# Altium schematic sheet rs232.SchDoc
size A
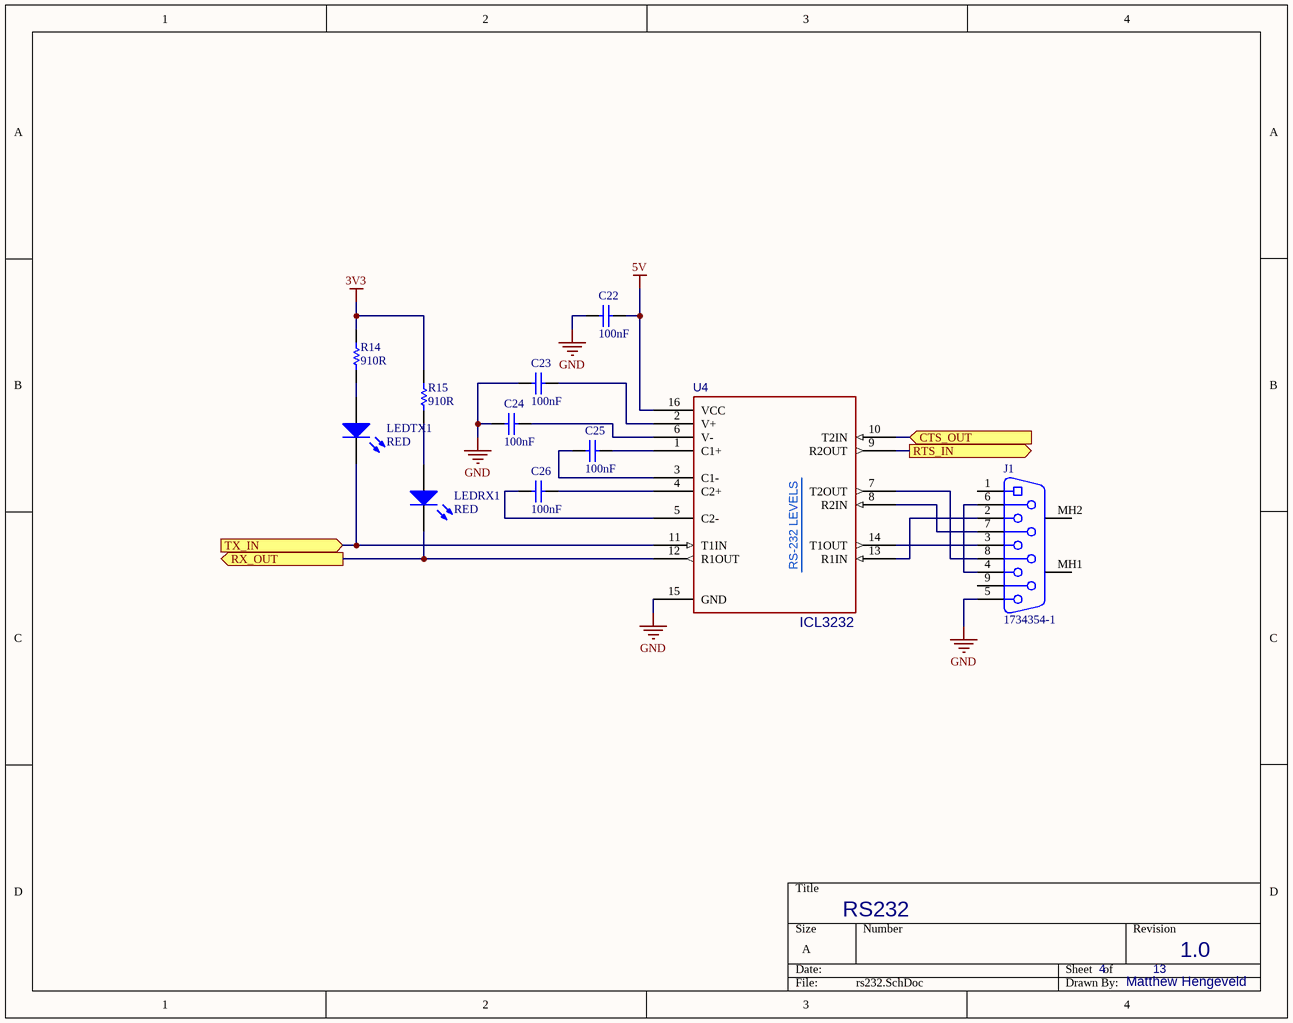
[diagram p0: rs232.SchDoc]

## Parts
C22  100nF  [CAPC1608X92X38LL15T08]
C23  100nF  [CAPC2013X94X50LL20T25]
C24  100nF  [CAPC2013X94X50LL20T25]
C25  100nF  [CAPC2013X94X50LL20T25]
C26  100nF  [CAPC2013X94X50LL20T25]
J1  1734354-1  [TE-1734354-1-9_V]
LEDRX1  RED  [0805_A]
LEDTX1  RED  [0805_A]
R14  910R  [RESC1609X50X30LL10T20]
R15  910R  [RESC1609X50X30LL10T20]
U4  RS232 Transciever  [TSSOP-16]  (value not drawn)

## Ports
CTS_OUT (in), RTS_IN (out), RX_OUT (out), TX_IN (in)

## Nets
3V3: R14.2 R15.2
5V: C22.2 U4.16(VCC)
GND: C22.1 C23.2 C24.2 J1.5 U4.15(GND)
CTS_OUT: U4.10(T2IN) ; port CTS_OUT
RTS_IN: U4.9(R2OUT) ; port RTS_IN
RX_OUT: LEDRX1.1(K) U4.12(R1OUT) ; port RX_OUT
TX_IN: LEDTX1.1(K) U4.11(T1IN) ; port TX_IN
NetC23_1: C23.1 U4.2(V+)
NetC24_1: C24.1 U4.6(V-)
NetC25_1: C25.1 U4.1(C1+)
NetC25_2: C25.2 U4.3(C1-)
NetC26_1: C26.1 U4.5(C2-)
NetC26_2: C26.2 U4.4(C2+)
NetJ1_2: J1.2 U4.13(R1IN)
NetJ1_3: J1.3 U4.14(T1OUT)
NetJ1_4: J1.4 J1.6
NetJ1_7: J1.7 U4.8(R2IN)
NetJ1_8: J1.8 U4.7(T2OUT)
NetLEDRX1_2: LEDRX1.2(A) R15.1
NetLEDTX1_2: LEDTX1.2(A) R14.1

Not connected (* = marked no-connect by the designer): J1 1 9 MH1 MH2

## Notes on the sheet
- RS232
- 4
- 13
- 1.0
- Matthew Hengeveld
- (in symbol ICL3232) RS-232 LEVELS

## Library data of the parts
C22 = CMP-2006-01974-1: Part Number: VJ0603Y104KNXAO; Manufacturer: Vitramon
C23-C26 = CMP-2007-04370-1: Part Number: 08055C104K4T2A; Manufacturer: AVX Interconnect / Elco
J1 = CMP-2000-05403-1: D-Subminiature Socket, Pitch 1.385 mm, 9 Position, Height 12.5 mm, Tail Length 3.2 mm, RoHS, Tray; Manufacturer: TE Connectivity; Connector Type: Receptacle,FemaleSockets; Number of Positions: 9; Connector Style: D-Sub; Catalog Drawings: AMPD-SubMale.318; 3D Model: 1734354-1.pdf; Flange Feature: MatingSide;FemaleScrewlock(4-40); Other Names: A35107; Current Rating: 2A; Voltage Rating: 250V; Mating Products: AML09B-ND / -CONND-SUBPLUG9POSGOLD; Featured Product: AMPLIMITED-SubminiatureConnectors; Product Training Modules: AMPLIMITED-SubConnectors; Dynamic Catalog: AMPLIMITEHD-20Series; Manufacturer URL: http://www.te.com/; Number of Rows: 2; Contact Type: Signal; RoHS Information: 1734354-1StatementofCompliance; Datasheet URL: http://www.te.com.cn/chn-zh/search.html?q=1734354-1&source=header#pdp-optional-registration; Features: BoardLock; Standard Package: 90; Family: D-SubConnectors; Datasheet Version: Rev. A1, 03/2011; Shell Material, Finish: Steel,NickelPlated; Color: Black; Contact Finish Thickness: Flash; Shell Size, Connector Layout: 1(DE,E); Mounting Type: ThroughHole,RightAngle; Contact Finish: Gold; Termination: Solder; Housing Material: Polyamide(PA9T),Nylon9T,GlassFilled; Operating Temperature: -55degC~105degC; Category: Connectors,Interconnects; Series: AMPLIMITEHD-20
LEDRX1 LEDTX1 = CMP-1426-00011-1: SMD mono-color Chip LED, WL-SMCW, Red; PartNumber: 150080RS75000; Manufacturer: Wuerth Elektronik; Color: Red; PackageReference: 0805_A; ComponentLink2Description: Datasheet; ComponentLink1URL: http://www.we-online.com; ComponentLink1Description: Manufacturer URL; ComponentLink2URL: http://katalog.we-online.com/led/datasheet/150080RS75000.pdf
R14 R15 = CMP-2000-03413-1: Part Number: CRCW06034K70JNEA; Manufacturer: Vishay Dale
U4 = ICL3232